# EAGLE design Edgework (EAGLE 9.5.2)
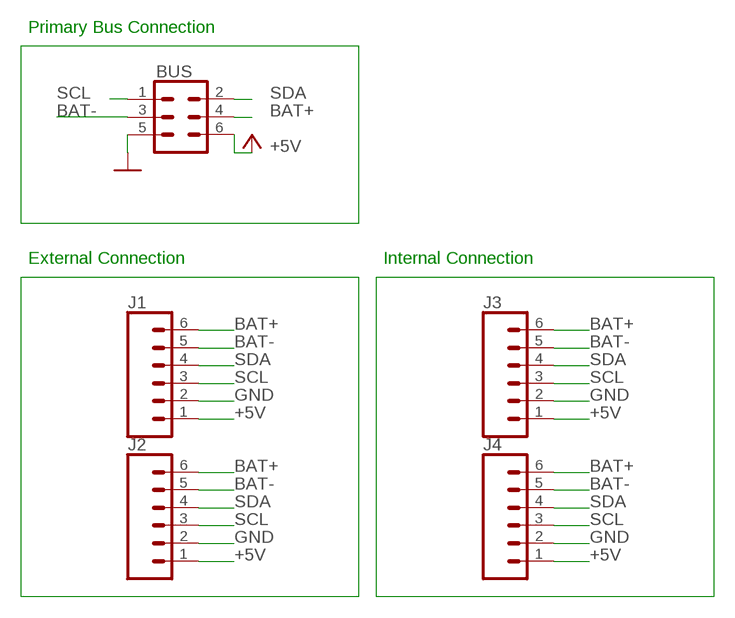
[diagram p0: schematic, sheet 1]

## Parts
BUS  CONN_03X2SHROUD  [2X3-SHROUDED]
J1  CONN_06NO_SILK_FEMALE_PTH  [1X06_NO_SILK]
J2  CONN_06NO_SILK_FEMALE_PTH  [1X06_NO_SILK]
J3  CONN_06NO_SILK_FEMALE_PTH  [1X06_NO_SILK]
J4  CONN_06NO_SILK_FEMALE_PTH  [1X06_NO_SILK]

## Nets
+5V: BUS.6 J1.1 J2.1 J3.1 J4.1
BAT+: BUS.4 J1.6 J2.6 J3.6 J4.6
BAT-: BUS.3 J1.5 J2.5 J3.5 J4.5
GND: BUS.5 J1.2 J2.2 J3.2 J4.2
SCL: BUS.1 J1.3 J2.3 J3.3 J4.3
SDA: BUS.2 J1.4 J2.4 J3.4 J4.4

## Notes on the sheet
- Primary Bus Connection
- External Connection | Internal Connection

## Library data of the parts
BUS = SparkFun-Connectors:CONN_03X2: Multi connection point. Often used as Generic Header-pin footprint for 0.1 inch spaced/style header connections You can populate with any combo of single row headers, but if you'd like an exact match, check these: Header - 2x3 (Male, 0.1") <https://www.sparkfun.com/products/12807> (PRT-12807) Header - 2x3 (Female, 0.1") <https://www.sparkfun.com/products/13010> (PRT-13010) 2x3 Pin Shrouded Header <https://www.sparkfun.com/products/10877> (PRT-10877) On any of the 0.1 inch spaced packages, you can populate with these: Break Away Headers - Straight <https://www.sparkfun.com/products/116> (PRT-00116) Break Away Male Headers - Right Angle <https://www.sparkfun.com/products/553> (PRT-00553) Female Headers <https://www.sparkfun.com/products/115> (PRT-00115) Break Away Headers - Machine Pin <https://www.sparkfun.com/products/117> (PRT-00117) Break Away Female Headers - Swiss Machine Pin <https://www.sparkfun.com/products/743> (PRT-00743) Special note: the shrouded connector mates well with our 3x2 ribbon cables: Ribbon Crimp Connector - 6-pin (2x3, Female) <https://www.sparkfun.com/products/10651> (PRT-10651) Ribbon Cable - 6 wire (15ft) <https://www.sparkfun.com/products/10646> (PRT-10646); PROD_ID: CONN-10681; SF_ID: PRT_10877
J1-J4 = SparkFun-Connectors:CONN_06: Multi connection point. Often used as Generic Header-pin footprint for 0.1 inch spaced/style header connections On any of the 0.1 inch spaced packages, you can populate with these: Break Away Headers - Straight <https://www.sparkfun.com/products/116> (PRT-00116) Break Away Male Headers - Right Angle <https://www.sparkfun.com/products/553> (PRT-00553) Female Headers <https://www.sparkfun.com/products/115> (PRT-00115) Break Away Headers - Machine Pin <https://www.sparkfun.com/products/117> (PRT-00117) Break Away Female Headers - Swiss Machine Pin <https://www.sparkfun.com/products/743> (PRT-00743) Arduino Stackable Header - 6 Pin <https://www.sparkfun.com/products/9280> (PRT-09280) For SCREWTERMINALS and SPRING TERMINALS visit here: Screw Terimnals on SparkFun.com <https://www.sparkfun.com/search/results?term=Screw+Terminals> (5mm/3.5mm/2.54mm spacing) This device is also useful as a general connection point to wire up your design to another part of your project. Our various solder wires solder well into these plated through hole pads. Hook-Up Wire - Assortment (Stranded, 22 AWG) <https://www.sparkfun.com/products/11375> (PRT-11375) Hook-Up Wire - Assortment (Solid Core, 22 AWG) <https://www.sparkfun.com/products/11367> (PRT-11367) View the entire wire category on our website here <https://www.sparkfun.com/categories/141>; PROD_ID: CONN-08437

## Board
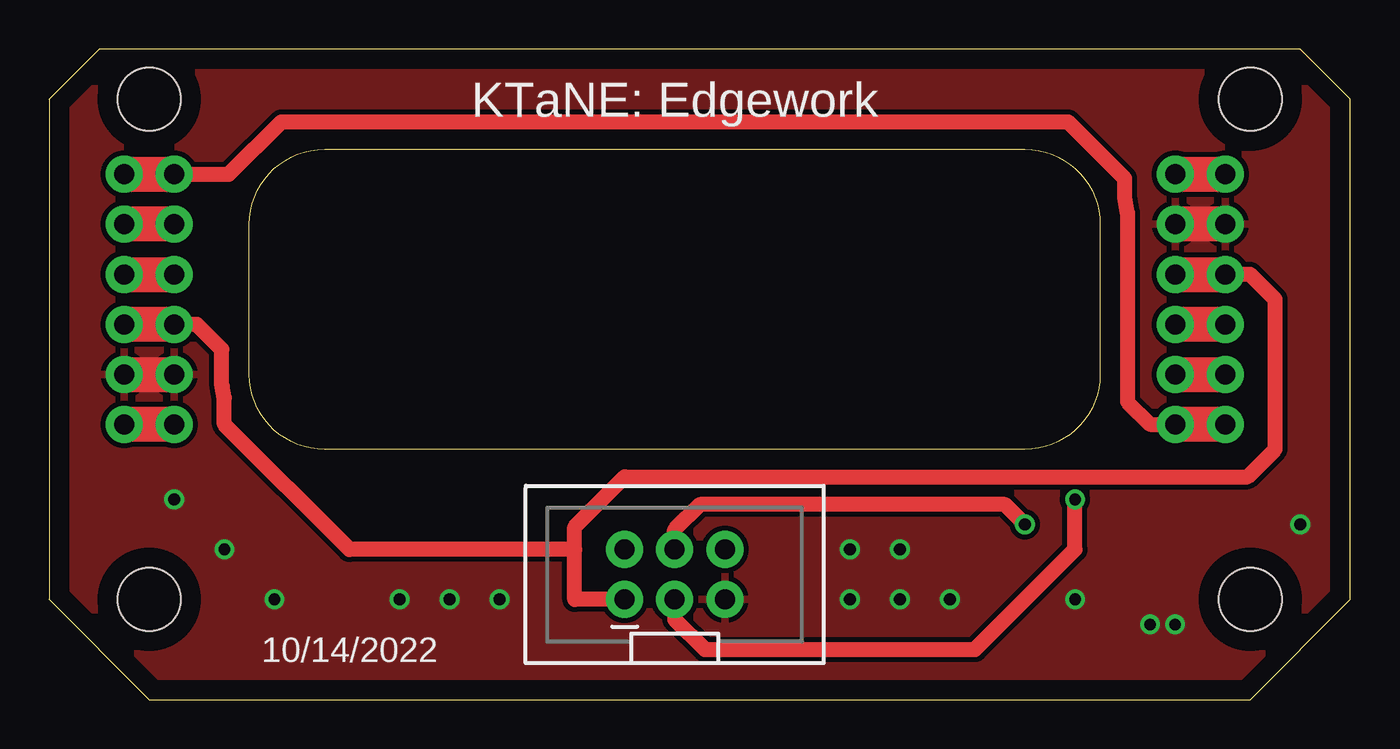
[diagram p1: board, top side]
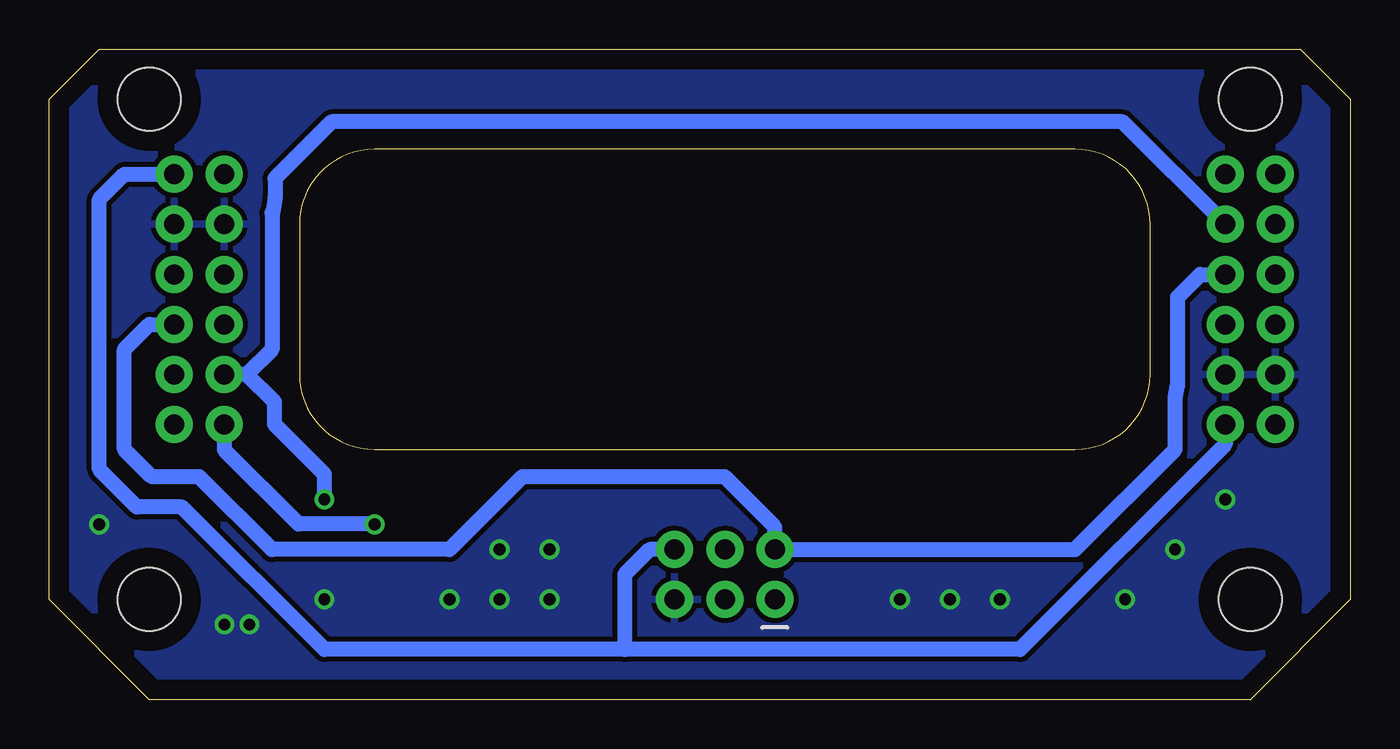
[diagram p2: board, bottom side, seen from below]

Size 66.04 x 33.02 mm. Coordinates in mm from the lower left corner, seen from the top.
Outline: 5.08,0 60.96,0 66.04,5.08 66.04,30.48 63.5,33.02 2.54,33.02 0,30.48 0,5.08 5.08,0
Outline: 10.16,24.13 arc-90 13.97,27.94 49.53,27.94 arc-90 53.34,24.13 53.34,16.51 arc-90 49.53,12.7 13.97,12.7 arc-90 10.16,16.51 10.16,24.13
Copper layers (1*16): Top 0.035mm / dielectric 1.5mm / Bottom 0.035mm
Design rules "default": minimum track width 6mil, minimum drill 0.35mm, track to track 6mil, track to pad 6mil, pad to pad 6mil, via to via 6mil, smd to smd 6mil, copper to edge 40mil, drill to drill 6mil, minimum pad ring 10mil, minimum via ring 8mil, stop-mask expansion 4mil, vias tented up to drill 0mil, thermal gap 10mil
Holes 3.2 mm at 5.08,5.08 60.96,5.08 5.08,30.48 60.96,30.48

### Footprints (pad centres in the part's own frame; a part is rotated, then mirrored left to right if it is on the bottom)
2X3-SHROUDED = drill 1.016 pad 1.88: 1 -1.27,2.54; 2 1.27,2.54; 3 -1.27,0; 4 1.27,0; 5 -1.27,-2.54; 6 1.27,-2.54
1X06_NO_SILK = drill 1.016 pad 1.88: 1 0,0; 2 2.54,0; 3 5.08,0; 4 7.62,0; 5 10.16,0; 6 12.7,0

### Placement (x,y rotation side)
BUS  31.75,6.35 90 top
J1  6.35,13.97 90 top
J2  57.15,26.67 270 top
J3  3.81,13.97 90 top
J4  59.69,26.67 270 top

### Tracks (layer width: path | path; a pad name or v marks a point on that pad's centre or on a via)
+5V
  Top 1.778: J1.1 J3.1 | J2.1 J4.1
  Bottom 0.762: J4.1 62.23,26.67 63.5,25.4 63.5,11.68 61.59,9.78 59.31,9.78 52.07,2.54 36.83,2.54 | 36.83,2.54 16.76,2.54 6.35,12.95 J1.1 | BUS.6 35.56,7.62 36.83,6.35 36.83,2.54
BAT+  (via drill 0.6)
  Top 0.762: J1.6 9.12,26.67 11.79,29.34 51.72,29.34 54.58,26.47 54.58,25.48 54.71,24.73 54.74,24.71 54.74,15.11 55.88,13.97 J2.6 | BUS.4 31.75,8.64 33.02,9.91 48.51,9.91 v49.53,8.89
  Top 1.778: J3.6 J1.6 | J4.6 J2.6
  Bottom 0.762: v49.53,8.89 49.55,8.91 53.39,8.91 57.15,12.67 J2.6
BAT-  (via drill 0.6)
  Top 0.762: BUS.3 31.75,4.06 33.27,2.54 46.99,2.54 52.07,7.62 v52.07,10.16
  Top 1.778: J1.5 J3.5 | J2.5 J4.5
  Bottom 0.762: J1.5 11.56,29.34 51.72,29.34 54.58,26.47 54.58,25.48 54.71,24.73 54.74,24.71 54.74,17.78 56.01,16.51 | 56.01,16.51 J2.5 | v52.07,10.16 52.07,11.43 54.61,13.97 54.61,15.11 56.01,16.51
GND  (via drill 0.6)
  Top 1.778: J3.2 J1.2 | J4.2 J2.2
  other vias: 40.64,7.62 40.64,5.08 43.18,5.08 43.18,7.62 8.89,7.62 6.35,10.16 11.43,5.08 17.78,5.08 20.32,5.08 22.86,5.08 45.72,5.08 52.07,5.08 55.88,3.81 57.15,3.81 63.5,8.89
  pour Bottom (isolate 0.254): 0,0 0,33.02 66.04,33.02 66.04,0
  pour Top (isolate 0.254): 0,0 0,33.02 66.04,33.02 66.04,0
SCL
  Top 0.762: BUS.1 26.67,5.08 26.67,7.62 | 26.67,7.62 15.24,7.62 8.89,13.97 8.89,15.33 8.79,15.9 8.76,15.93 8.76,17.78 7.49,19.05 J1.3 | J4.3 60.96,21.59 62.23,20.32 62.23,12.7 60.83,11.3 29.21,11.3 26.67,8.76 26.67,7.62
  Top 1.778: J1.3 J3.3 | J2.3 J4.3
SDA
  Top 1.778: J3.4 J1.4 | J4.4 J2.4
  Bottom 0.762: J1.4 7.62,21.59 8.76,20.45 8.76,15.93 8.79,15.9 8.89,15.33 8.89,12.7 13.97,7.62 BUS.2 29.21,8.76 31.75,11.3 42.04,11.3 45.72,7.62 54.74,7.62 58.42,11.3 60.83,11.3 62.23,12.7 62.23,17.78 60.96,19.05 J4.4

### Text on the board
tPlace: KTaNE: Edgework | 10/14/2022